# Altium schematic sheet MCU+IO.SchDoc: MCU
size A3; DrawnBy: Mogens Groth Nicolaisen; DocumentNumber: 3; SheetNumber: 3; SheetTotal: 7
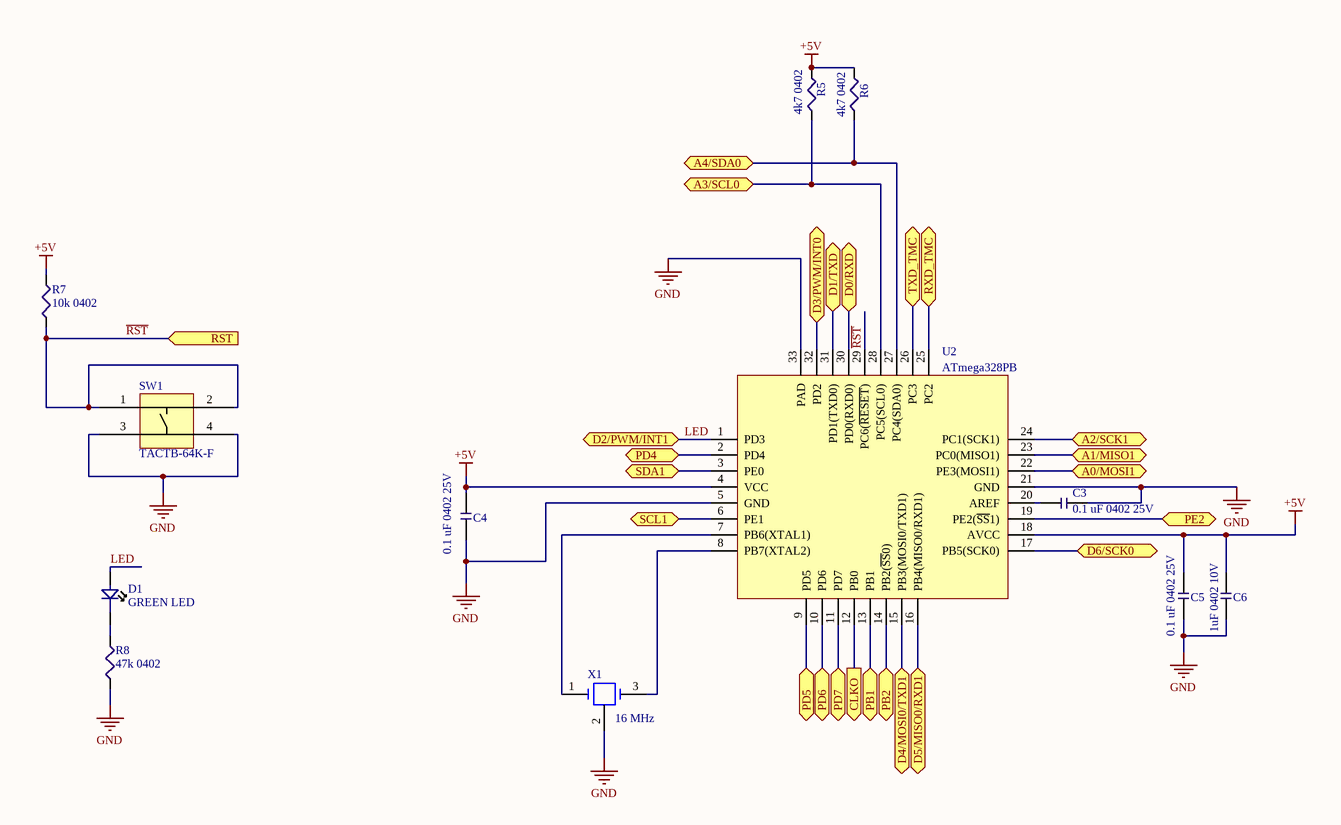
[diagram p0: MCU+IO.SchDoc]

## Parts
C3  0.1 uF 0402 25V  [CAP_0402]
C4  0.1 uF 0402 25V  [CAP_0402]
C5  0.1 uF 0402 25V  [CAP_0402]
C6  1uF 0402 10V  [CAP_0402]
D1  GREEN LED  [0402 LED]
R5  4k7 0402  [RES_0402]
R6  4k7 0402  [RES_0402]
R7  10k 0402  [RES_0402]
R8  47k 0402  [RES_0402]
SW1  TACTB-64K-F  [TACTB-64K-F]
U2  ATmega328PB  [QFN50P500X500X90_HS-33N]
X1  16 MHz  [CSTCE16XTAL]

## Ports
A0/MOSI1 (bidir), A1/MISO1 (bidir), A2/SCK1 (bidir), A3/SCL0 (bidir), A4/SDA0 (bidir), CLKO (out), D0/RXD (bidir), D1/TXD (bidir), D2/PWM/INT1 (bidir), D3/PWM/INT0 (bidir), D4/MOSI0/TXD1 (bidir), D5/MISO0/RXD1 (bidir), D6/SCK0 (bidir), PB1 (bidir), PB2 (bidir), PD4 (bidir), PD5 (bidir), PD6 (bidir), PD7 (bidir), PE2 (bidir), RST (in), RXD_TMC (bidir), SCL1 (bidir), SDA1 (bidir), TXD_TMC (bidir)

## Nets
+5V: C4.1 C5.2 C6.2 R5.2 R6.2 R7.2 U2.4(VCC) U2.18(AVCC)
GND: C3.1 C4.2 C5.1 C6.1 R8.1 SW1.3 SW1.4 U2.5(GND) U2.21(GND) U2.33(PAD) X1.2(GND)
~{RST}: R7.1 SW1.1 SW1.2 U2.29(PC6(~{RESET})) ; port RST
A0/MOSI1: U2.22(PE3(MOSI1)) ; port A0/MOSI1
A1/MISO1: U2.23(PC0(MISO1)) ; port A1/MISO1
A2/SCK1: U2.24(PC1(SCK1)) ; port A2/SCK1
A3/SCL0: R5.1 U2.28(PC5(SCL0)) ; port A3/SCL0
A4/SDA0: R6.1 U2.27(PC4(SDA0)) ; port A4/SDA0
CLKO: U2.12(PB0) ; port CLKO
D0/RXD: U2.30(PD0(RXD0)) ; port D0/RXD
D1/TXD: U2.31(PD1(TXD0)) ; port D1/TXD
D3/PWM/INT0: U2.32(PD2) ; port D3/PWM/INT0
D4/MOSI0/TXD1: U2.15(PB3(MOSI0/TXD1)) ; port D4/MOSI0/TXD1
D5/MISO0/RXD1: U2.16(PB4(MISO0/RXD1)) ; port D5/MISO0/RXD1
D6/SCK0: U2.17(PB5(SCK0)) ; port D6/SCK0
LED: D1.1 U2.1(PD3) ; port D2/PWM/INT1
PB1: U2.13(PB1) ; port PB1
PB2: U2.14(PB2(~{SS}0)) ; port PB2
PD4: U2.2(PD4) ; port PD4
PD5: U2.9(PD5) ; port PD5
PD6: U2.10(PD6) ; port PD6
PD7: U2.11(PD7) ; port PD7
PE2: U2.19(PE2(~{SS}1)) ; port PE2
RXD_TMC: U2.25(PC2) ; port RXD_TMC
SCL1: U2.6(PE1) ; port SCL1
SDA1: U2.3(PE0) ; port SDA1
TXD_TMC: U2.26(PC3) ; port TXD_TMC
NetC3_2: C3.2 U2.20(AREF)
NetD1_2: D1.2 R8.2
NetU2_7: U2.7(PB6(XTAL1)) X1.1(OSC1)
NetU2_8: U2.8(PB7(XTAL2)) X1.3(OSC2)

## Notes on the sheet
- ON Development
- Title:
- Size:
- A3
- Drawn By:
- Date:
- Sheet
- of
- Revision:

## Library data of the parts
C3-C5 = CMP-00061-4: 0.1UF 25V 10% X5R 0402; Mfg. Part Number: TMK105BJ104KV-F; Tolerance: 10%; Value: 0.1 uF; Voltage: 25V
C6 = CMP-00032-4: 1uF 0402 10V 10% X5R; Tolerance: 10 %; Value: 1 uF; Voltage: 10 V
D1 = CMP-008-0001-2: 0402 SMD LED; Mfg. Part Number: LTST-C281KGKT
R5 R6 = CMP-001-0029-3: RES SMD 4.7K OHM 1% 1/16W 0402; Mfg. Part Number: RC1005F472CS; Tolerance: 1; Case/Package: 0402; Power: 1/16W; Value: 4k7
R7 = CMP-001-0019-3: RES SMD 10K OHM 1% 1/16W 0402; Mfg. Part Number: RMCF0402FT10K0; Case/Package: 0402; Power: 1/16 W; Tolerance: 1 %; Value: 10k
R8 = CMP-001-0027-3: RES SMD 47K OHM 1% 1/16W 0402; Mfg. Part Number: RMCF0402FT47K0; Case/Package: 0402; Power: 1/16W; Tolerance: 1%; Value: 47k
SW1 = CMP-013-0002-1: Microswitch TACT; SPST-NO; Positions:2; 0.05A/12VDC;; Case/Package: -; Mount: SMD; Pins: 4; RoHS: Yes; Mfg. Part No.: TACTB-64K-F
U2 = CMP-011-0001-4: IC MCU 8BIT 32KB FLASH 32TQFP; Case/Package: QFN-32; Mount: SMD; Pins: 32; RoHS: Yes
X1 = CMP-015-0002-4: CER RES 16.0000MHZ 15PF SMD; Mfg. Part Number: CSTCE16M0V53-R0; FootprintName1: CSTCE16XTAL; FootprintDescription1: CSTCE16M0V53-R0; FootprintRevisionID1: PCC-0038-1; Case/Package: -; Mount: SMD; Pins: 3; RoHS: Yes